# Altium project cam_cross_link_gen.PrjPcb
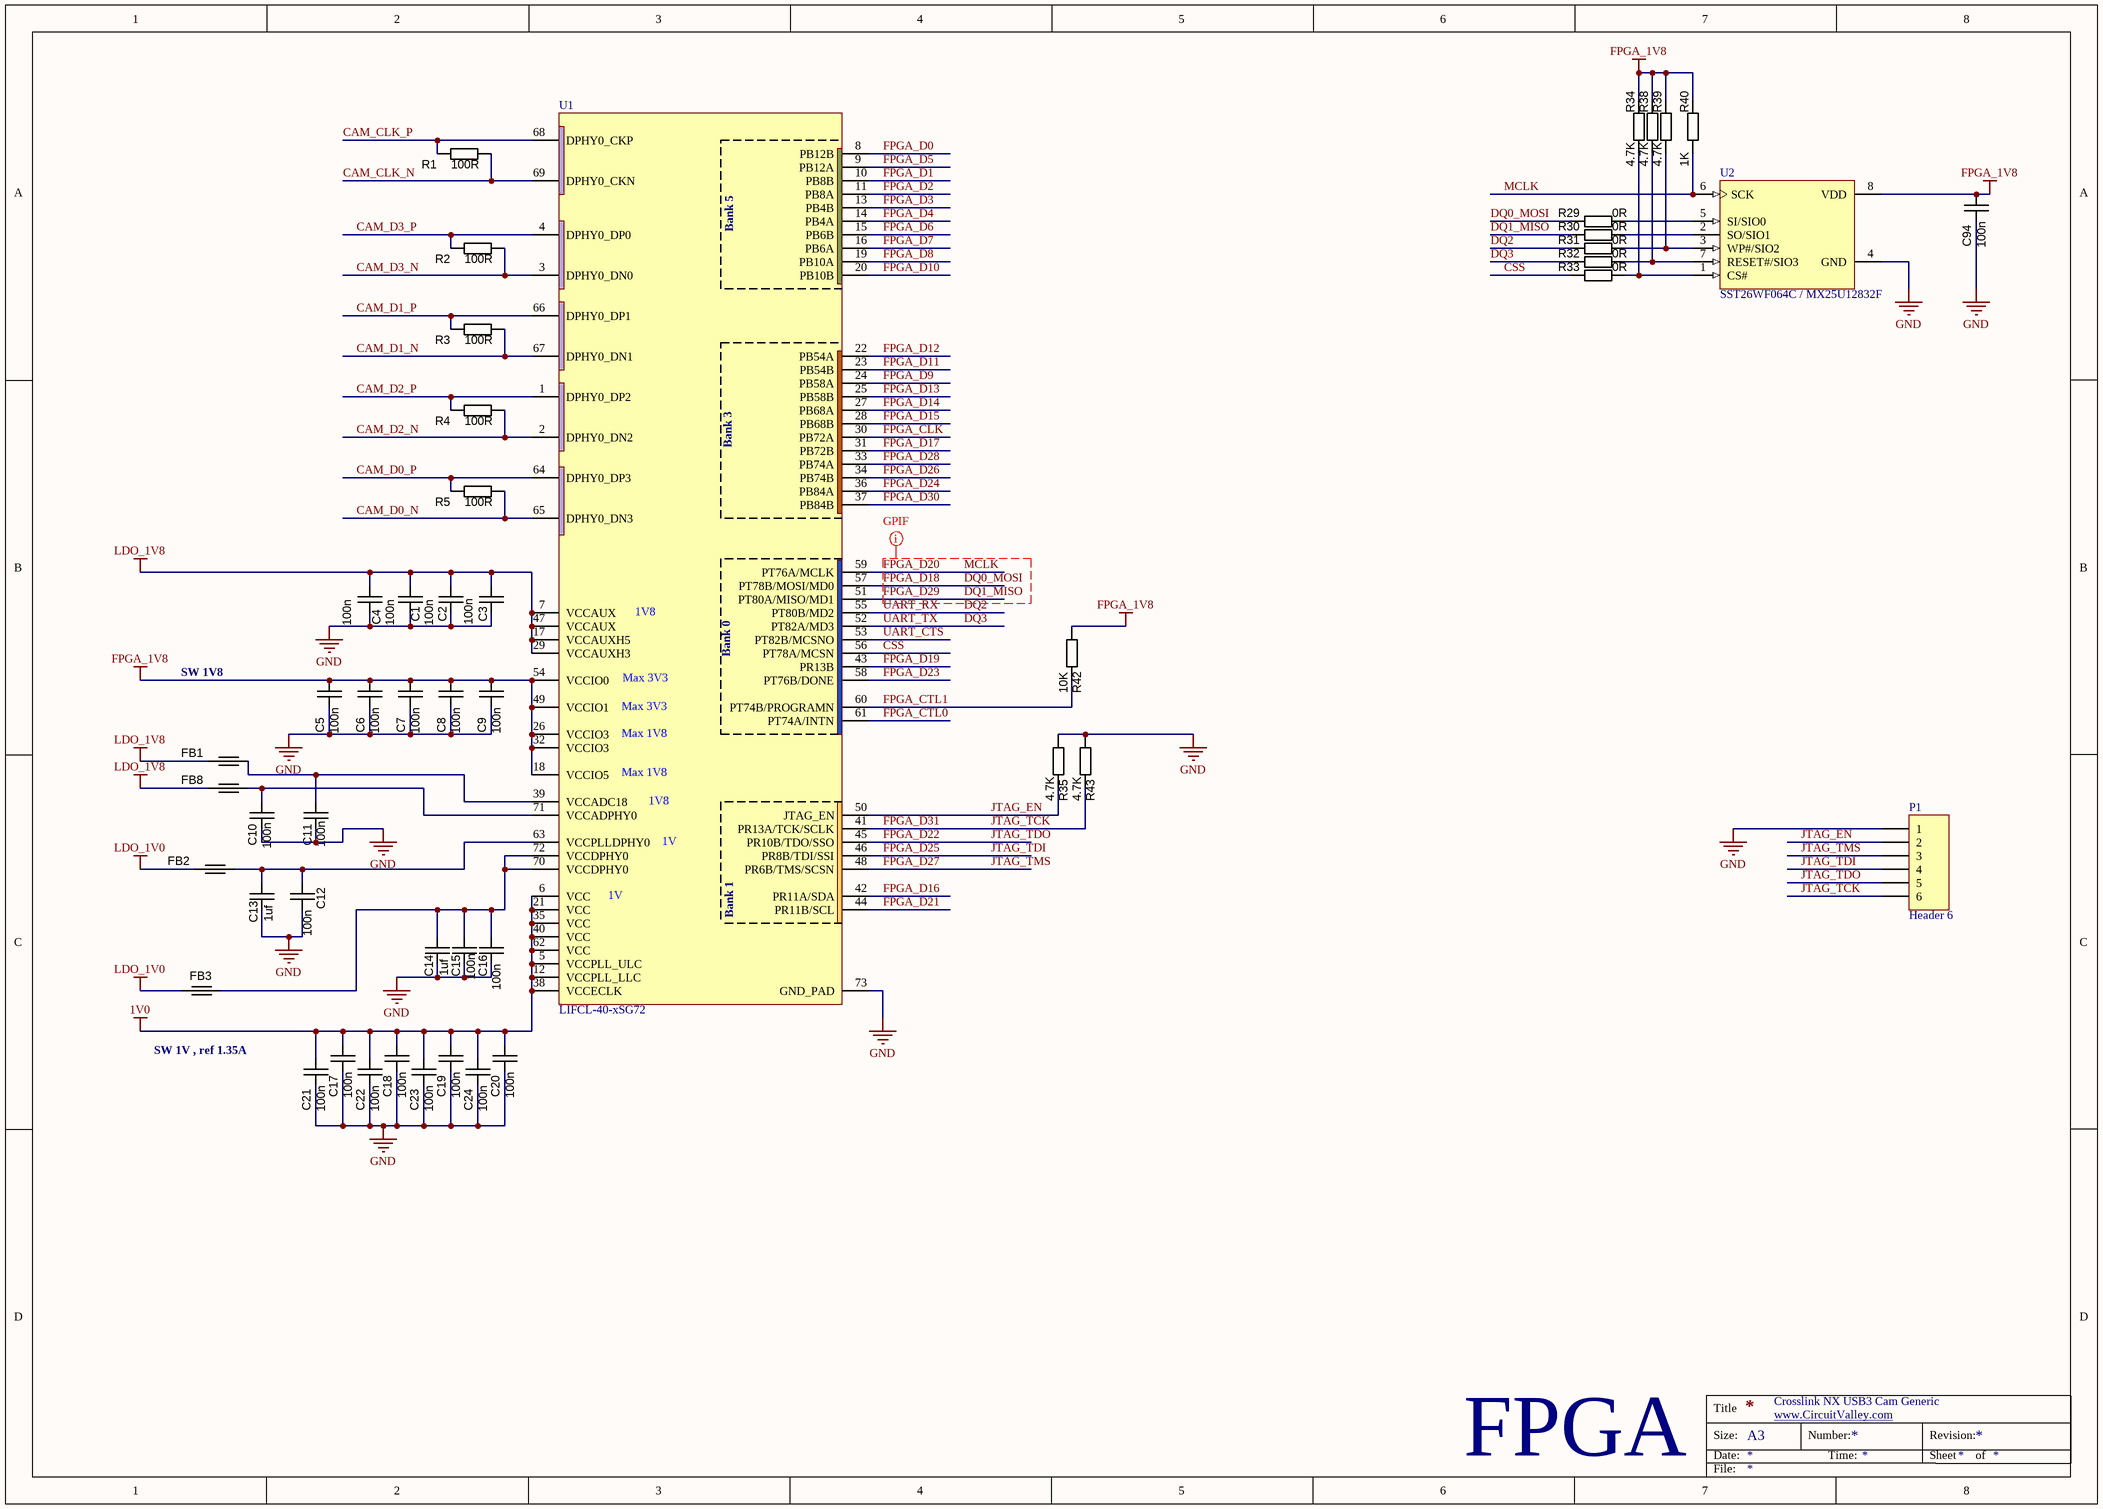
[diagram p0: cam_cross_link.SchDoc]
4 sheets, 173 parts. Net scope: global (net labels, ports and power ports of the same name join across sheets).
Board file: cam_cross_link_generic.PcbDoc
Sheets:
  cam_cross_link.SchDoc
  camera.SchDoc
  power.SchDoc
  usb.SchDoc

## Sheet cam_cross_link.SchDoc
size A3

### Parts
C1  100n  [CAPC1608N]
C2  100n  [CAPC1608N]
C3  100n  [CAPC1608N]
C4  100n  [CAPC1608N]
C5  100n  [CAPC1608N]
C6  100n  [CAPC1608N]
C7  100n  [CAPC1608N]
C8  100n  [CAPC1608N]
C9  100n  [CAPC1608N]
C10  100n  [CAPC1608N]
C11  100n  [CAPC1608N]
C12  100n  [CAPC1608N]
C13  1uf  [CAPC1608N]
C14  1uf  [CAPC1608N]
C15  100n  [CAPC1608N]
C16  100n  [CAPC1608N]
C17  100n  [CAPC1608N]
C18  100n  [CAPC1608N]
C19  100n  [CAPC1608N]
C20  100n  [CAPC1608N]
C21  100n  [CAPC1608N]
C22  100n  [CAPC1608N]
C23  100n  [CAPC1608N]
C24  100n  [CAPC1608N]
C94  100n  [CAPC1608N]
FB1  (no value)  [FBC2012N]
FB2  (no value)  [FBC2012N]
FB3  (no value)  [FBC2012N]
FB8  (no value)  [FBC2012N]
P1  Header 6  [SMD_Solder_points_1.27]
R1  value 100R  [RESC1005N]  (hidden comment: Thick Film)
R2  value 100R  [RESC1005N]  (hidden comment: Thick Film)
R3  value 100R  [RESC1005N]  (hidden comment: Thick Film)
R4  value 100R  [RESC1005N]  (hidden comment: Thick Film)
R5  value 100R  [RESC1005N]  (hidden comment: Thick Film)
R29  value 0R  [RESC1608N_ZERO]  (hidden comment: Thick Film)
R30  value 0R  [RESC1608N_ZERO]  (hidden comment: Thick Film)
R31  value 0R  [RESC1608N_ZERO]  (hidden comment: Thick Film)
R32  value 0R  [RESC1608N_ZERO]  (hidden comment: Thick Film)
R33  value 0R  [RESC1608N_ZERO]  (hidden comment: Thick Film)
R34  value 4.7K  [RESC1608N_ZERO]  (hidden comment: Thick Film)
R35  value 4.7K  [RESC1608N_ZERO]  (hidden comment: Thick Film)
R38  value 4.7K  [RESC1608N_ZERO]  (hidden comment: Thick Film)
R39  value 4.7K  [RESC1608N_ZERO]  (hidden comment: Thick Film)
R40  value 1K  [RESC1608N_ZERO]  (hidden comment: Thick Film)
R42  value 10K  [RESC1608N_ZERO]  (hidden comment: Thick Film)
R43  value 4.7K  [RESC1608N_ZERO]  (hidden comment: Thick Film)
U1  LIFCL-40-xSG72  [QFN72_NX]
U2  SST26WF064C / MX25U12832F  [SOP8]

### Nets
1V0: C17.2 C18.2 C19.2 C20.2 C21.2 C22.2 C23.2 C24.2 U1.5(VCCPLL_ULC) U1.6(VCC) U1.12(VCCPLL_LLC) U1.21(VCC) U1.35(VCC) U1.38(VCCECLK) U1.40(VCC) U1.62(VCC)
FPGA_1V8: C5.2 C6.2 C7.2 C8.2 C9.2 C94.2 R34.1 R38.1 R39.1 R40.1 R42.1 U1.18(VCCIO5) U1.26(VCCIO3) U1.32(VCCIO3) U1.49(VCCIO1) U1.54(VCCIO0) U2.8(VDD)
GND: C1.1 C2.1 C3.1 C4.1 C5.1 C6.1 C7.1 C8.1 C9.1 C10.1 C11.1 C12.2 C13.1 C14.1 C15.1 C16.1 C17.1 C18.1 C19.1 C20.1 C21.1 C22.1 C23.1 C24.1 C94.1 P1.1 R35.1 R43.1 U1.73(GND_PAD) U2.4(GND)
LDO_1V0: FB2.1 FB3.1
LDO_1V8: C1.2 C2.2 C3.2 C4.2 FB1.1 FB8.1 U1.7(VCCAUX) U1.17(VCCAUXH5) U1.29(VCCAUXH3) U1.47(VCCAUX)
CAM_CLK_N: R1.1 U1.69(DPHY0_CKN)
CAM_CLK_P: R1.2 U1.68(DPHY0_CKP)
CAM_D0_N: R5.1 U1.65(DPHY0_DN3)
CAM_D0_P: R5.2 U1.64(DPHY0_DP3)
CAM_D1_N: R3.1 U1.67(DPHY0_DN1)
CAM_D1_P: R3.2 U1.66(DPHY0_DP1)
CAM_D2_N: R4.1 U1.2(DPHY0_DN2)
CAM_D2_P: R4.2 U1.1(DPHY0_DP2)
CAM_D3_N: R2.1 U1.3(DPHY0_DN0)
CAM_D3_P: R2.2 U1.4(DPHY0_DP0)
CSS: R33.2 U1.56(PT78A/MCSN)
DQ0_MOSI: R29.2 U1.57(PT78B/MOSI/MD0)  [also labelled FPGA_D18]
DQ1_MISO: R30.2 U1.51(PT80A/MISO/MD1)  [also labelled FPGA_D29]
DQ2: R31.2 U1.55(PT80B/MD2)  [also labelled UART_RX]
DQ3: R32.2 U1.52(PT82A/MD3)  [also labelled UART_TX]
FPGA_CLK: U1.30(PB72A)
FPGA_CTL0: U1.61(PT74A/INTN)
FPGA_CTL1: R42.2 U1.60(PT74B/PROGRAMN)
FPGA_D0: U1.8(PB12B)
FPGA_D1: U1.10(PB8B)
FPGA_D2: U1.11(PB8A)
FPGA_D3: U1.13(PB4B)
FPGA_D4: U1.14(PB4A)
FPGA_D5: U1.9(PB12A)
FPGA_D6: U1.15(PB6B)
FPGA_D7: U1.16(PB6A)
FPGA_D8: U1.19(PB10A)
FPGA_D9: U1.24(PB58A)
FPGA_D10: U1.20(PB10B)
FPGA_D11: U1.23(PB54B)
FPGA_D12: U1.22(PB54A)
FPGA_D13: U1.25(PB58B)
FPGA_D14: U1.27(PB68A)
FPGA_D15: U1.28(PB68B)
FPGA_D16: U1.42(PR11A/SDA)
FPGA_D17: U1.31(PB72B)
FPGA_D19: U1.43(PR13B)
FPGA_D20: R40.2 U1.59(PT76A/MCLK) U2.6(SCK)  [also labelled MCLK]
FPGA_D21: U1.44(PR11B/SCL)
FPGA_D22: P1.5 U1.45(PR10B/TDO/SSO)  [also labelled JTAG_TDO]
FPGA_D23: U1.58(PT76B/DONE)
FPGA_D24: U1.36(PB84A)
FPGA_D25: P1.4 U1.46(PR8B/TDI/SSI)  [also labelled JTAG_TDI]
FPGA_D26: U1.34(PB74B)
FPGA_D27: P1.3 U1.48(PR6B/TMS/SCSN)  [also labelled JTAG_TMS]
FPGA_D28: U1.33(PB74A)
FPGA_D30: U1.37(PB84B)
FPGA_D31: P1.6 R43.2 U1.41(PR13A/TCK/SCLK)  [also labelled JTAG_TCK]
JTAG_EN: P1.2 R35.2 U1.50(JTAG_EN)
UART_CTS: U1.53(PT82B/MCSNO)
NetC10_2: C10.2 FB8.2 U1.71(VCCADPHY0)
NetC11_2: C11.2 FB1.2 U1.39(VCCADC18)
NetC12_1: C12.1 C13.2 FB2.2 U1.63(VCCPLLDPHY0)
NetC14_2: C14.2 C15.2 C16.2 FB3.2 U1.70(VCCDPHY0) U1.72(VCCDPHY0)
NetR29_1: R29.1 U2.5(SI/SIO0)
NetR30_1: R30.1 U2.2(SO/SIO1)
NetR31_1: R31.1 R39.2 U2.3(WP#/SIO2)
NetR32_1: R32.1 R38.2 U2.7(RESET#/SIO3)
NetR33_1: R33.1 R34.2 U2.1(CS#)

### Layout directives
net class GPIF: DQ0_MOSI, DQ1_MISO, FPGA_D18, FPGA_D20, FPGA_D29, MCLK

### Notes on the sheet
- SW 1V8
- SW 1V , ref 1.35A
- Crosslink NX USB3 Cam Generic
- www.CircuitValley.com <http://www.CircuitValley.com>
- FPGA
- Title
- Size:
- Date:
- A3
- Number:
- Time:
- Revision:
- Sheet
- of
- File:
- (in symbol LIFCL-40-xSG72) Bank 5; Bank 3; 1V8; Bank 0; Max 3V3; Max 1V8; 1V; Bank 1

### Library data of the parts
C1-C24 C94 = CAPC_10p_0603_NP0_1%_50V: Capacitor SMD Cer 10pF 5% 50V NP0 0603; Manufacturer 1: Murata Electronics North America; Manufacturer Part Number 1: GRM1885C1H100FA01J; Part: C0603X104K5RAC; Ratings: 50V; NP0; Tolerance: ±5%; Operating Temperature: -55°C ~ 125°C; Package / Case: 0603 (1608 Metric); Size / Dimension: 0.063" L x 0.032" W (1.60mm x 0.81mm); Thickness (Max): 0.035" (0.90mm); Supplier 1: Digi-Key; Supplier Part Number 1: GRM1885C1H100FA01J-ND
  C1-C12 C15-C24 C94: Value: 100n
  C13 C14: Value: 1uf
FB1-FB3 FB8 = FERRITE_0805: Ferrite bead 2.2K Ohm at 100 MHz 200mA 0805 SMD; Manufacturer 1: Laird-Signal Integrity Products; Manufacturer Part Number 1: HZ0805B222R-10; Ratings: 200 mA; 800 mOhm DC; Impedance @ Frequency: 600 Ohm @ 100MHz; DC Resistance (DCR): 800 mOhm Max; Filter Type: Differential Mode - Single; Size / Dimension: 0.063" L x 0.031" W (1.60mm x 0.80mm); Current Rating: 200mA; Package / Case: 0805 (2012 Metric); Height (Max): 0.043" (1.09mm); ComponentLink1URL: http://www.lairdtech.com/WorkArea/linkit.aspx?LinkIdentifier=id&ItemID=4879; ComponentLink1Description: http://www.lairdtech.com/WorkArea/linkit.aspx?LinkIdentifier=id&ItemID=4879; Supplier 1: Digi-Key; Supplier Part Number 1: 240-2562-1-ND; Mounting Type: Surface Mount
P1 = Header 6: Header, 6-Pin; LatestRevisionDate: 17-Jul-2002; LatestRevisionNote: Re-released for DXP Platform.; Publisher: Altium Limited
R1-R5 = RES_1M_0402_5%: Resistor SMD chip 1M Ohm 0.063W 5% 0402; Manufacturer 1: Vishay Dale; Manufacturer Part Number 1: CRCW04021M00JNED; Ratings: 1/16 W; Power Rating: 0.063W, 1/16W; Package / Case: 0402 (1005 Metric); Tolerance: ±5%; Material: Thick Film; Manufacturer 2: Yageo; Manufacturer Part Number 2: RC0402JR-071ML; Supplier 1: Digi-Key; Supplier Part Number 1: 541-1.0MJCT-ND; ComponentLink1URL: http://www.vishay.com/doc?20035; ComponentLink1Description: http://www.vishay.com/doc?20035; Supplier 2: Digi-Key; Supplier Part Number 2: 311-1.0MJRCT-ND; ComponentLink2URL: http://www.yageo.com/documents/recent/PYu-RC0402_51_RoHS_L_6.pdf; ComponentLink2Description: http://www.yageo.com/documents/recent/PYu-RC0402_51_RoHS_L_6.pdf
R29-R35 R38-R40 R42 R43 = RES_0R_0603: Resistor SMD chip 0.0 Ohm 0.1W 0603; Manufacturer 1: Vishay/Dale; Manufacturer Part Number 1: CRCW06030000Z0EA; Tolerance: ±5%; Ratings: 1/10W; Package / Case: 0603 (1608metric); Supplier 1: Digi-Key; Supplier Part Number 1: 541-0.0GCT-ND
U1 = LIFCL-40-xSG72: QFN 72 LIFCL
U2 = MX25L12833F: Flash 128Mbit for Lattice FPGA

## Sheet camera.SchDoc
size A3
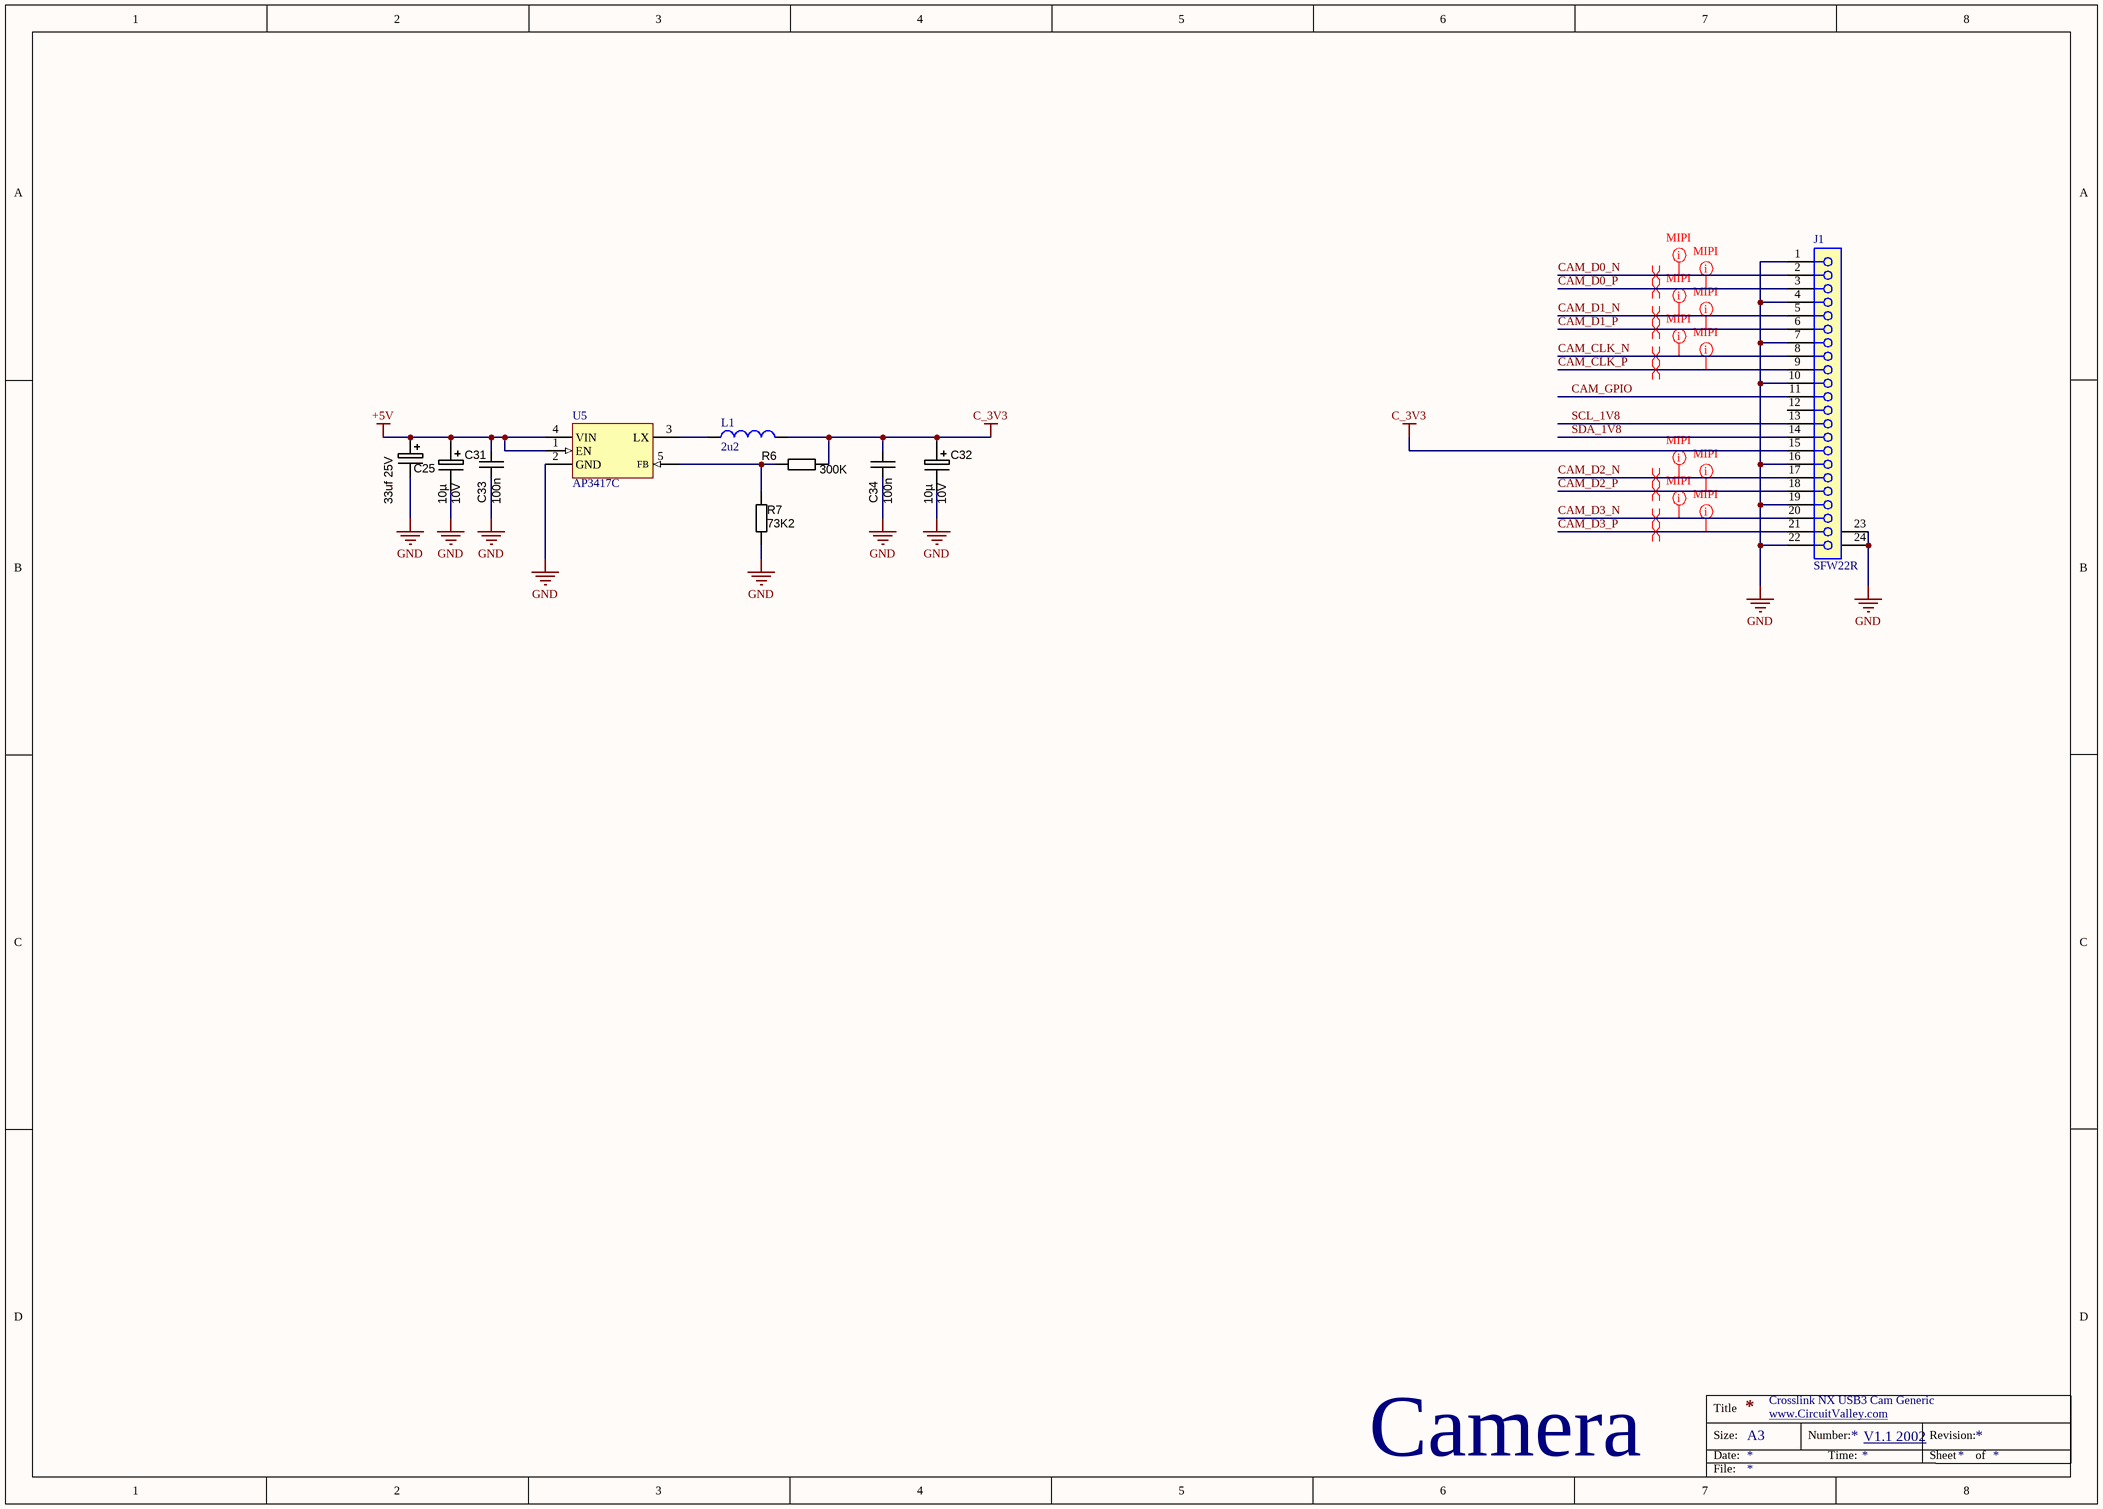
[diagram p1: camera.SchDoc]

### Parts
C25  value 33uf 25V  [CAPMP7343X310N]  (hidden comment: 33uf 20V D)
C31  Ratings: 10V  [CAPMP3528X210N]  (hidden comment: 10µ)
C32  Ratings: 10V  [CAPMP3528X210N]  (hidden comment: 10µ)
C33  100n  [CAPC1608N]
C34  100n  [CAPC1608N]
J1  SFW22R  [SFW22R]
L1  2u2  [TAIYO_NRS4018T2R2MDGJ]
R6  value 300K  [RESC1608N_ZERO]  (hidden comment: Thick Film)
R7  value 73K2  [RESC1608N_ZERO]  (hidden comment: Thick Film)
U5  AP3417C  [SOT23-5]

### Nets
+5V: C25.1 C31.1 C33.2 U5.1(EN) U5.4(VIN)
C_3V3: C32.1 C34.2 J1.15 L1.2 R6.1
GND: C25.2 C31.2 C32.2 C33.1 C34.1 J1.1 J1.4 J1.7 J1.10 J1.16 J1.19 J1.22 J1.23 J1.24 R7.2 U5.2(GND)
CAM_CLK_N: J1.8
CAM_CLK_P: J1.9
CAM_D0_N: J1.2
CAM_D0_P: J1.3
CAM_D1_N: J1.5
CAM_D1_P: J1.6
CAM_D2_N: J1.17
CAM_D2_P: J1.18
CAM_D3_N: J1.20
CAM_D3_P: J1.21
CAM_GPIO: J1.11
SCL_1V8: J1.13
SDA_1V8: J1.14
NetL1_1: L1.1 U5.3(LX)
NetR6_2: R6.2 R7.1 U5.5(FB)

Not connected (* = marked no-connect by the designer): J1 12

### Layout directives
differential pair: CAM_CLK_N, CAM_CLK_P, CAM_D0_N, CAM_D0_P, CAM_D1_N, CAM_D1_P, CAM_D2_N, CAM_D2_P, CAM_D3_N, CAM_D3_P
net class MIPI: CAM_CLK_N, CAM_CLK_P, CAM_D0_N, CAM_D0_P, CAM_D1_N, CAM_D1_P, CAM_D2_N, CAM_D2_P, CAM_D3_N, CAM_D3_P

### Notes on the sheet
- Crosslink NX USB3 Cam Generic
- www.CircuitValley.com <http://www.CircuitValley.com>
- V1.1 2002
- Camera
- Title
- Size:
- Date:
- A3
- Number:
- Time:
- Revision:
- Sheet
- of
- File:

### Library data of the parts
C25 = CAPT_330u_2917_6V3: Capacitor SMD Tant 330uF 20% 6V3 2917; Manufacturer Part Number: T520D337M006ATE015; Part: TAJD336K020R; Ratings: 6.3V; Material: Solid Tantalum; ESR (Equivalent Series Resistance): 15 mOhm; Package / Case: 2917 (7343 Metric); Tolerance: ±20%; Operating Temperature: -55°C ~ 125°C; Size / Dimension: 0.287" L x 0.169" W (7.30mm x 4.30mm); Height - Seated (Max): 0.122" (3.10mm); Manufacturer Size Code: D; Supplier 1: Digi-Key; Supplier Part Number 1: 399-4052-1-ND; ComponentLink1URL: http://www.kemet.com/datasheets&T520D337M006ATE015; ComponentLink1Description: T520D Datasheet
C31 C32 = CAPT_47u_1210_6V3: Capacitor SMD Tantalum 47uF 20% 6.3V 1210; Manufacturer 1: AVX Corporation; Manufacturer Part Number 1: TCJB476M006R0070; Manufacturer Size Code: B; Voltage - Rated: 6V3; ESR (Equivalent Series Resistance): 70.0 mOhm; Type: Molded; Package / Case: 1210 (3528 Metric); Tolerance: ±20%; Material: Tantalum; Supplier 1: Digi-Key; Supplier Part Number 1: 478-3139-1-ND; Operating Temperature: -55°C ~ 125°C; Size / Dimension: 0.138" L x 0.110" W (3.50mm x 2.80mm); Height - Seated (Max): 0.083" (2.10mm); ComponentLink1URL: http://www.avx.com/docs/Catalogs/tcj.pdf; ComponentLink1Description: http://www.avx.com/docs/Catalogs/tcj.pdf; Value: 10µ
C33 C34 = CAPC_10p_0603_NP0_1%_50V: as C1 on sheet cam_cross_link; Tolerance: ±5%; Operating Temperature: -55°C ~ 125°C; Package / Case: 0603 (1608 Metric); Size / Dimension: 0.063" L x 0.032" W (1.60mm x 0.81mm); Thickness (Max): 0.035" (0.90mm); Supplier 1: Digi-Key; Supplier Part Number 1: GRM1885C1H100FA01J-ND; Value: 100n
J1 = SFW22R: 22 Pin FPC
L1 = inductor_smd: PartNumber: NRS4018T2R2MDGJ
R6 R7 = RES_0R_0603: as R29 on sheet cam_cross_link; Package / Case: 0603 (1608metric); Supplier 1: Digi-Key; Supplier Part Number 1: 541-0.0GCT-ND

## Sheet power.SchDoc
size A3
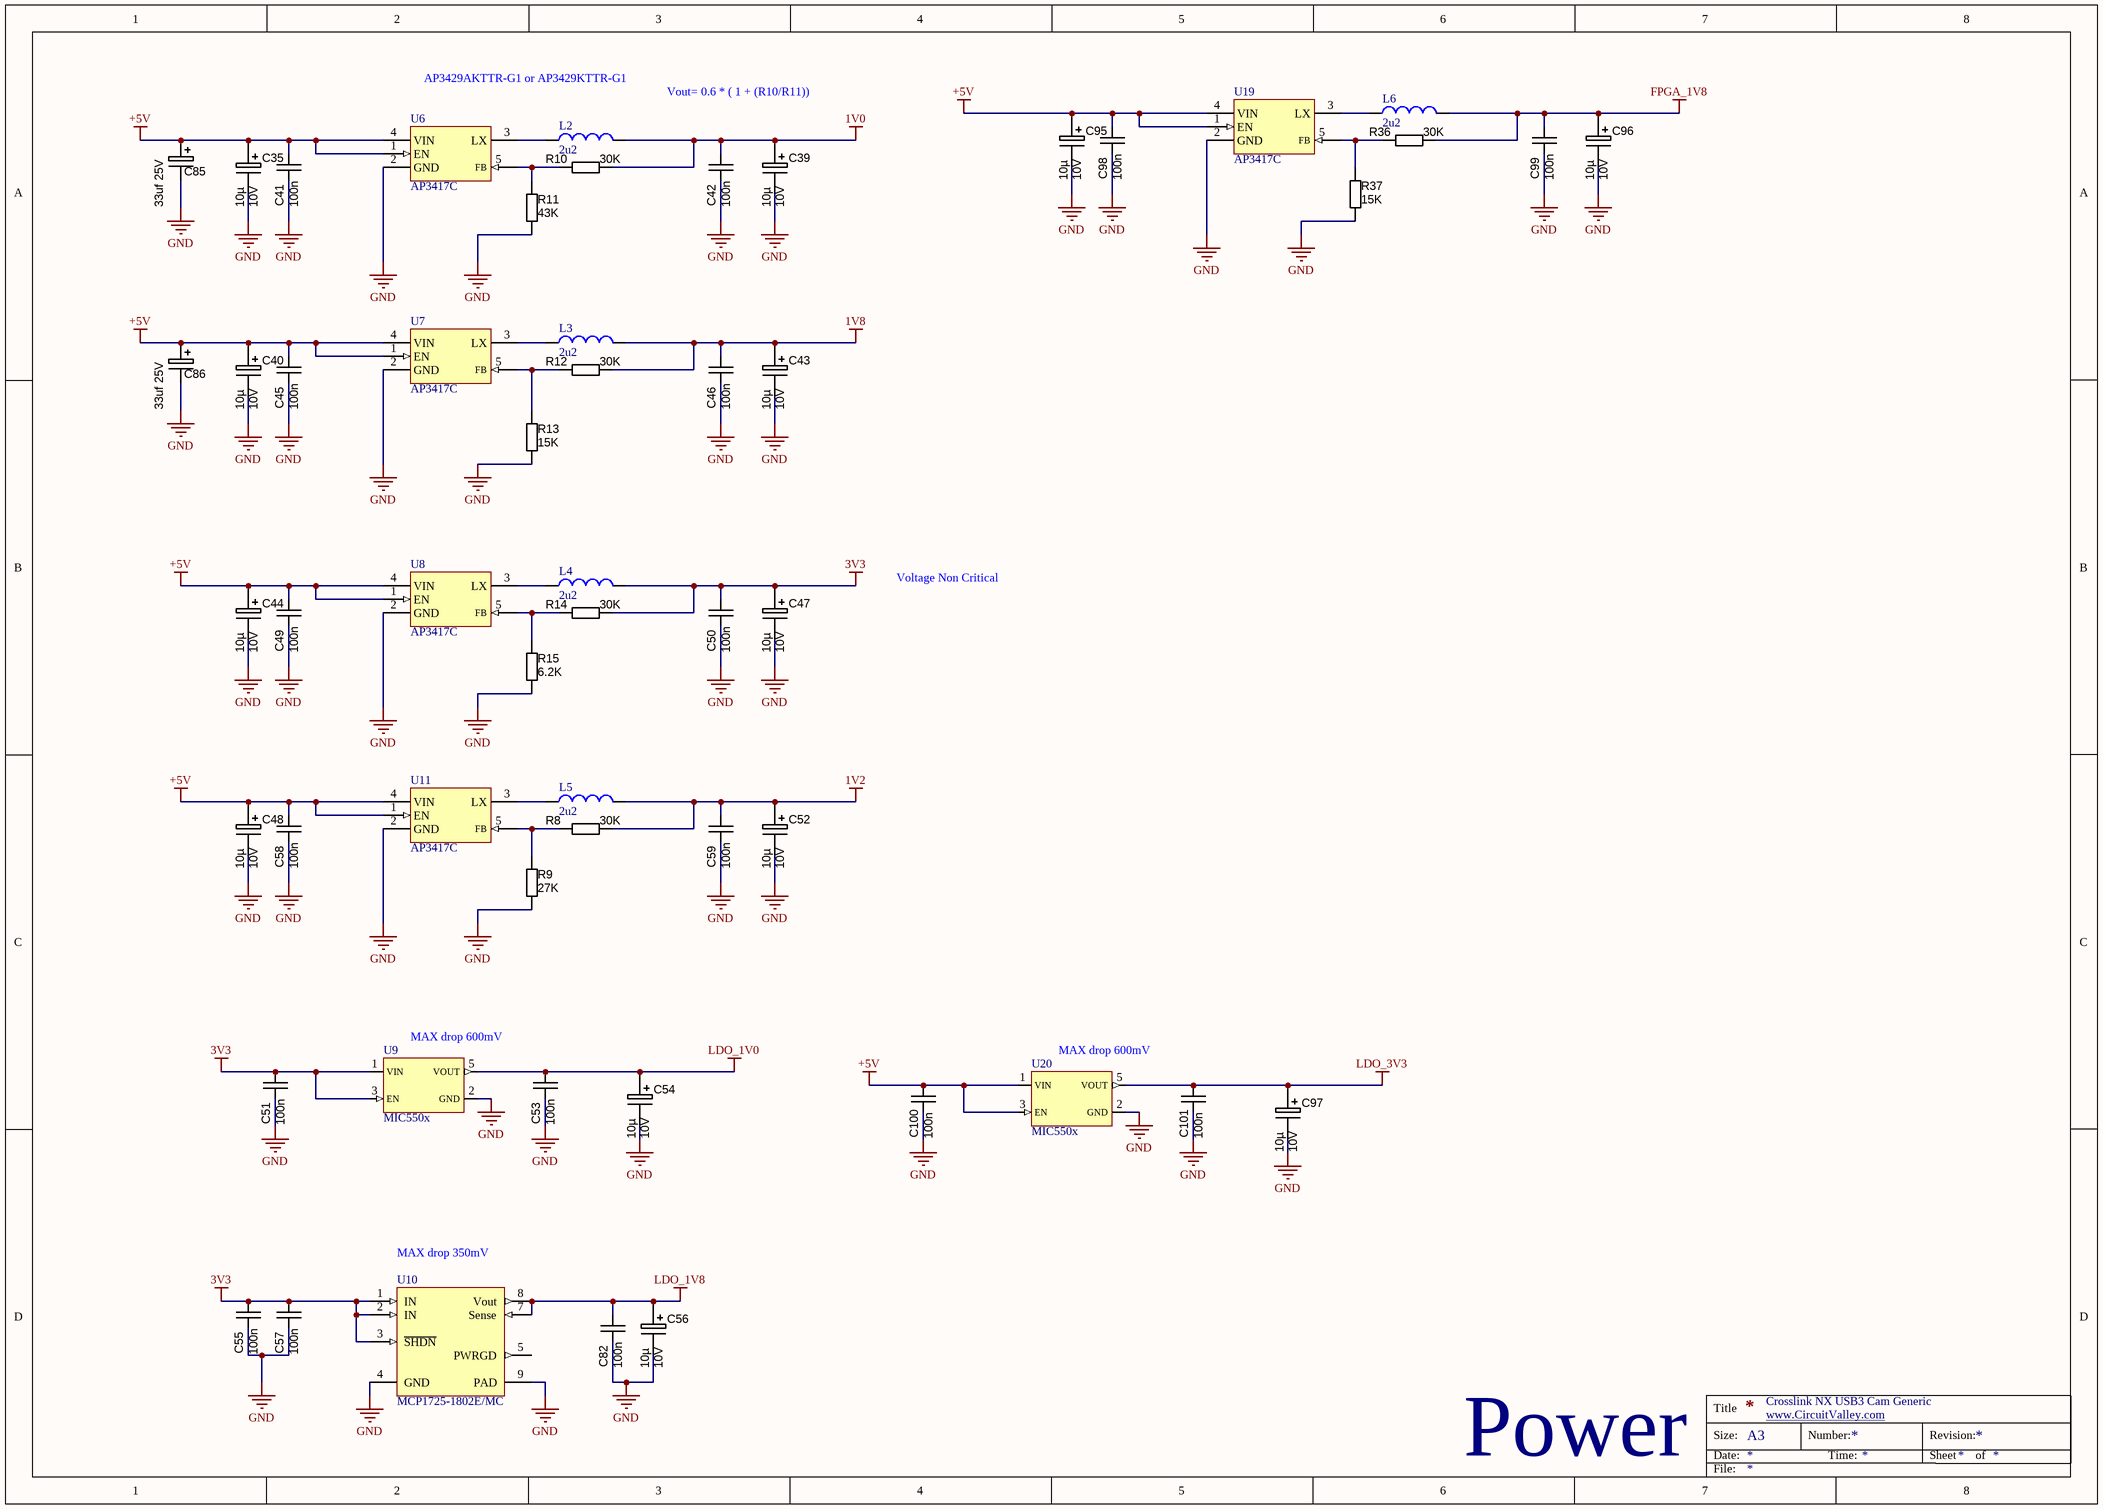
[diagram p2: power.SchDoc]

### Parts
C35  Ratings: 10V  [CAPMP3528X210N]  (hidden comment: 10µ)
C39  Ratings: 10V  [CAPMP3528X210N]  (hidden comment: 10µ)
C40  Ratings: 10V  [CAPMP3528X210N]  (hidden comment: 10µ)
C41  100n  [CAPC1608N]
C42  100n  [CAPC1608N]
C43  Ratings: 10V  [CAPMP3528X210N]  (hidden comment: 10µ)
C44  Ratings: 10V  [CAPMP3528X210N]  (hidden comment: 10µ)
C45  100n  [CAPC1608N]
C46  100n  [CAPC1608N]
C47  Ratings: 10V  [CAPMP3528X210N]  (hidden comment: 10µ)
C48  Ratings: 10V  [CAPMP3528X210N]  (hidden comment: 10µ)
C49  100n  [CAPC1608N]
C50  100n  [CAPC1608N]
C51  100n  [CAPC1608N]
C52  Ratings: 10V  [CAPMP3528X210N]  (hidden comment: 10µ)
C53  100n  [CAPC1608N]
C54  Ratings: 10V  [CAPMP3528X210N]  (hidden comment: 10µ)
C55  100n  [CAPC1608N]
C56  Ratings: 10V  [CAPMP3528X210N]  (hidden comment: 10µ)
C57  100n  [CAPC1608N]
C58  100n  [CAPC1608N]
C59  100n  [CAPC1608N]
C82  100n  [CAPC1608N]
C85  value 33uf 25V  [CAPMP7343X310N]  (hidden comment: 33uf 20V D)
C86  value 33uf 25V  [CAPMP7343X310N]  (hidden comment: 33uf 20V D)
C95  Ratings: 10V  [CAPMP3528X210N]  (hidden comment: 10µ)
C96  Ratings: 10V  [CAPMP3528X210N]  (hidden comment: 10µ)
C97  Ratings: 10V  [CAPMP3528X210N]  (hidden comment: 10µ)
C98  100n  [CAPC1608N]
C99  100n  [CAPC1608N]
C100  100n  [CAPC1608N]
C101  100n  [CAPC1608N]
L2  2u2  [TAIYO_NRS4018T2R2MDGJ]
L3  2u2  [TAIYO_NRS4018T2R2MDGJ]
L4  2u2  [TAIYO_NRS4018T2R2MDGJ]
L5  2u2  [TAIYO_NRS4018T2R2MDGJ]
L6  2u2  [TAIYO_NRS4018T2R2MDGJ]
R8  value 30K  [RESC1608N_ZERO]  (hidden comment: Thick Film)
R9  value 27K  [RESC1608N_ZERO]  (hidden comment: Thick Film)
R10  value 30K  [RESC1608N_ZERO]  (hidden comment: Thick Film)
R11  value 43K  [RESC1608N_ZERO]  (hidden comment: Thick Film)
R12  value 30K  [RESC1608N_ZERO]  (hidden comment: Thick Film)
R13  value 15K  [RESC1608N_ZERO]  (hidden comment: Thick Film)
R14  value 30K  [RESC1608N_ZERO]  (hidden comment: Thick Film)
R15  value 6.2K  [RESC1608N_ZERO]  (hidden comment: Thick Film)
R36  value 30K  [RESC1608N_ZERO]  (hidden comment: Thick Film)
R37  value 15K  [RESC1608N_ZERO]  (hidden comment: Thick Film)
U6  AP3417C  [SOT23-5]
U7  AP3417C  [SOT23-5]
U8  AP3417C  [SOT23-5]
U9  MIC550x  [SOT23-5]
U10  MCP1725-1802E/MC  [DFN8_3x2]
U11  AP3417C  [SOT23-5]
U19  AP3417C  [SOT23-5]
U20  MIC550x  [SOT23-5]

### Nets
1V0: C39.1 C42.2 L2.2 R10.1
1V2: C52.1 C59.2 L5.2 R8.1
1V8: C43.1 C46.2 L3.2 R12.1
3V3: C47.1 C50.2 C51.2 C55.2 C57.2 L4.2 R14.1 U9.1(VIN) U9.3(EN) U10.1(IN) U10.2(IN) U10.3(~{SHDN})
+5V: C35.1 C40.1 C41.2 C44.1 C45.2 C48.1 C49.2 C58.2 C85.1 C86.1 C95.1 C98.2 C100.2 U6.1(EN) U6.4(VIN) U7.1(EN) U7.4(VIN) U8.1(EN) U8.4(VIN) U11.1(EN) U11.4(VIN) U19.1(EN) U19.4(VIN) U20.1(VIN) U20.3(EN)
FPGA_1V8: C96.1 C99.2 L6.2 R36.1
GND: C35.2 C39.2 C40.2 C41.1 C42.1 C43.2 C44.2 C45.1 C46.1 C47.2 C48.2 C49.1 C50.1 C51.1 C52.2 C53.1 C54.2 C55.1 C56.2 C57.1 C58.1 C59.1 C82.1 C85.2 C86.2 C95.2 C96.2 C97.2 C98.1 C99.1 C100.1 C101.1 R9.2 R11.2 R13.2 R15.2 R37.2 U6.2(GND) U7.2(GND) U8.2(GND) U9.2(GND) U10.4(GND) U10.9(PAD) U11.2(GND) U19.2(GND) U20.2(GND)
LDO_1V0: C53.2 C54.1 U9.5(VOUT)
LDO_1V8: C56.1 C82.2 U10.7(Sense) U10.8(Vout)
LDO_3V3: C97.1 C101.2 U20.5(VOUT)
NetL2_1: L2.1 U6.3(LX)
NetL3_1: L3.1 U7.3(LX)
NetL4_1: L4.1 U8.3(LX)
NetL5_1: L5.1 U11.3(LX)
NetL6_1: L6.1 U19.3(LX)
NetR8_2: R8.2 R9.1 U11.5(FB)
NetR10_2: R10.2 R11.1 U6.5(FB)
NetR12_2: R12.2 R13.1 U7.5(FB)
NetR14_2: R14.2 R15.1 U8.5(FB)
NetR36_2: R36.2 R37.1 U19.5(FB)

Not connected (* = marked no-connect by the designer): U10 5(PWRGD)

### Notes on the sheet
- AP3429AKTTR-G1 or AP3429KTTR-G1
- Vout= 0.6 * ( 1 + (R10/R11))
- Voltage Non Critical
- (near U9) MAX drop 600mV
- (near U20) MAX drop 600mV
- (near U10) MAX drop 350mV
- Crosslink NX USB3 Cam Generic
- www.CircuitValley.com <http://www.CircuitValley.com>
- Power
- Title
- Size:
- Date:
- A3
- Number:
- Time:
- Revision:
- Sheet
- of
- File:

### Library data of the parts
C35 C39 C40 C43 C44 C47 C48 C52 C54 C56 C95-C97 = CAPT_47u_1210_6V3: as C31 on sheet camera; Package / Case: 1210 (3528 Metric); Tolerance: ±20%; Material: Tantalum; Supplier 1: Digi-Key; Supplier Part Number 1: 478-3139-1-ND; Operating Temperature: -55°C ~ 125°C; Size / Dimension: 0.138" L x 0.110" W (3.50mm x 2.80mm); Height - Seated (Max): 0.083" (2.10mm); ComponentLink1URL: http://www.avx.com/docs/Catalogs/tcj.pdf; ComponentLink1Description: http://www.avx.com/docs/Catalogs/tcj.pdf; Value: 10µ
C41 C42 C45 C46 C49-C51 C53 C55 C57-C59 C82 C98-C101 = CAPC_10p_0603_NP0_1%_50V: as C1 on sheet cam_cross_link; Tolerance: ±5%; Operating Temperature: -55°C ~ 125°C; Package / Case: 0603 (1608 Metric); Size / Dimension: 0.063" L x 0.032" W (1.60mm x 0.81mm); Thickness (Max): 0.035" (0.90mm); Supplier 1: Digi-Key; Supplier Part Number 1: GRM1885C1H100FA01J-ND; Value: 100n
C85 C86 = CAPT_330u_2917_6V3: as C25 on sheet camera; Package / Case: 2917 (7343 Metric); Tolerance: ±20%; Operating Temperature: -55°C ~ 125°C; Size / Dimension: 0.287" L x 0.169" W (7.30mm x 4.30mm); Height - Seated (Max): 0.122" (3.10mm); Manufacturer Size Code: D; Supplier 1: Digi-Key; Supplier Part Number 1: 399-4052-1-ND; ComponentLink1URL: http://www.kemet.com/datasheets&T520D337M006ATE015; ComponentLink1Description: T520D Datasheet
L2-L6 = inductor_smd: PartNumber: NRS4018T2R2MDGJ
R8-R15 R36 R37 = RES_0R_0603: as R29 on sheet cam_cross_link; Package / Case: 0603 (1608metric); Supplier 1: Digi-Key; Supplier Part Number 1: 541-0.0GCT-ND
U10 = MCP1725: LDO

## Sheet usb.SchDoc
size A3
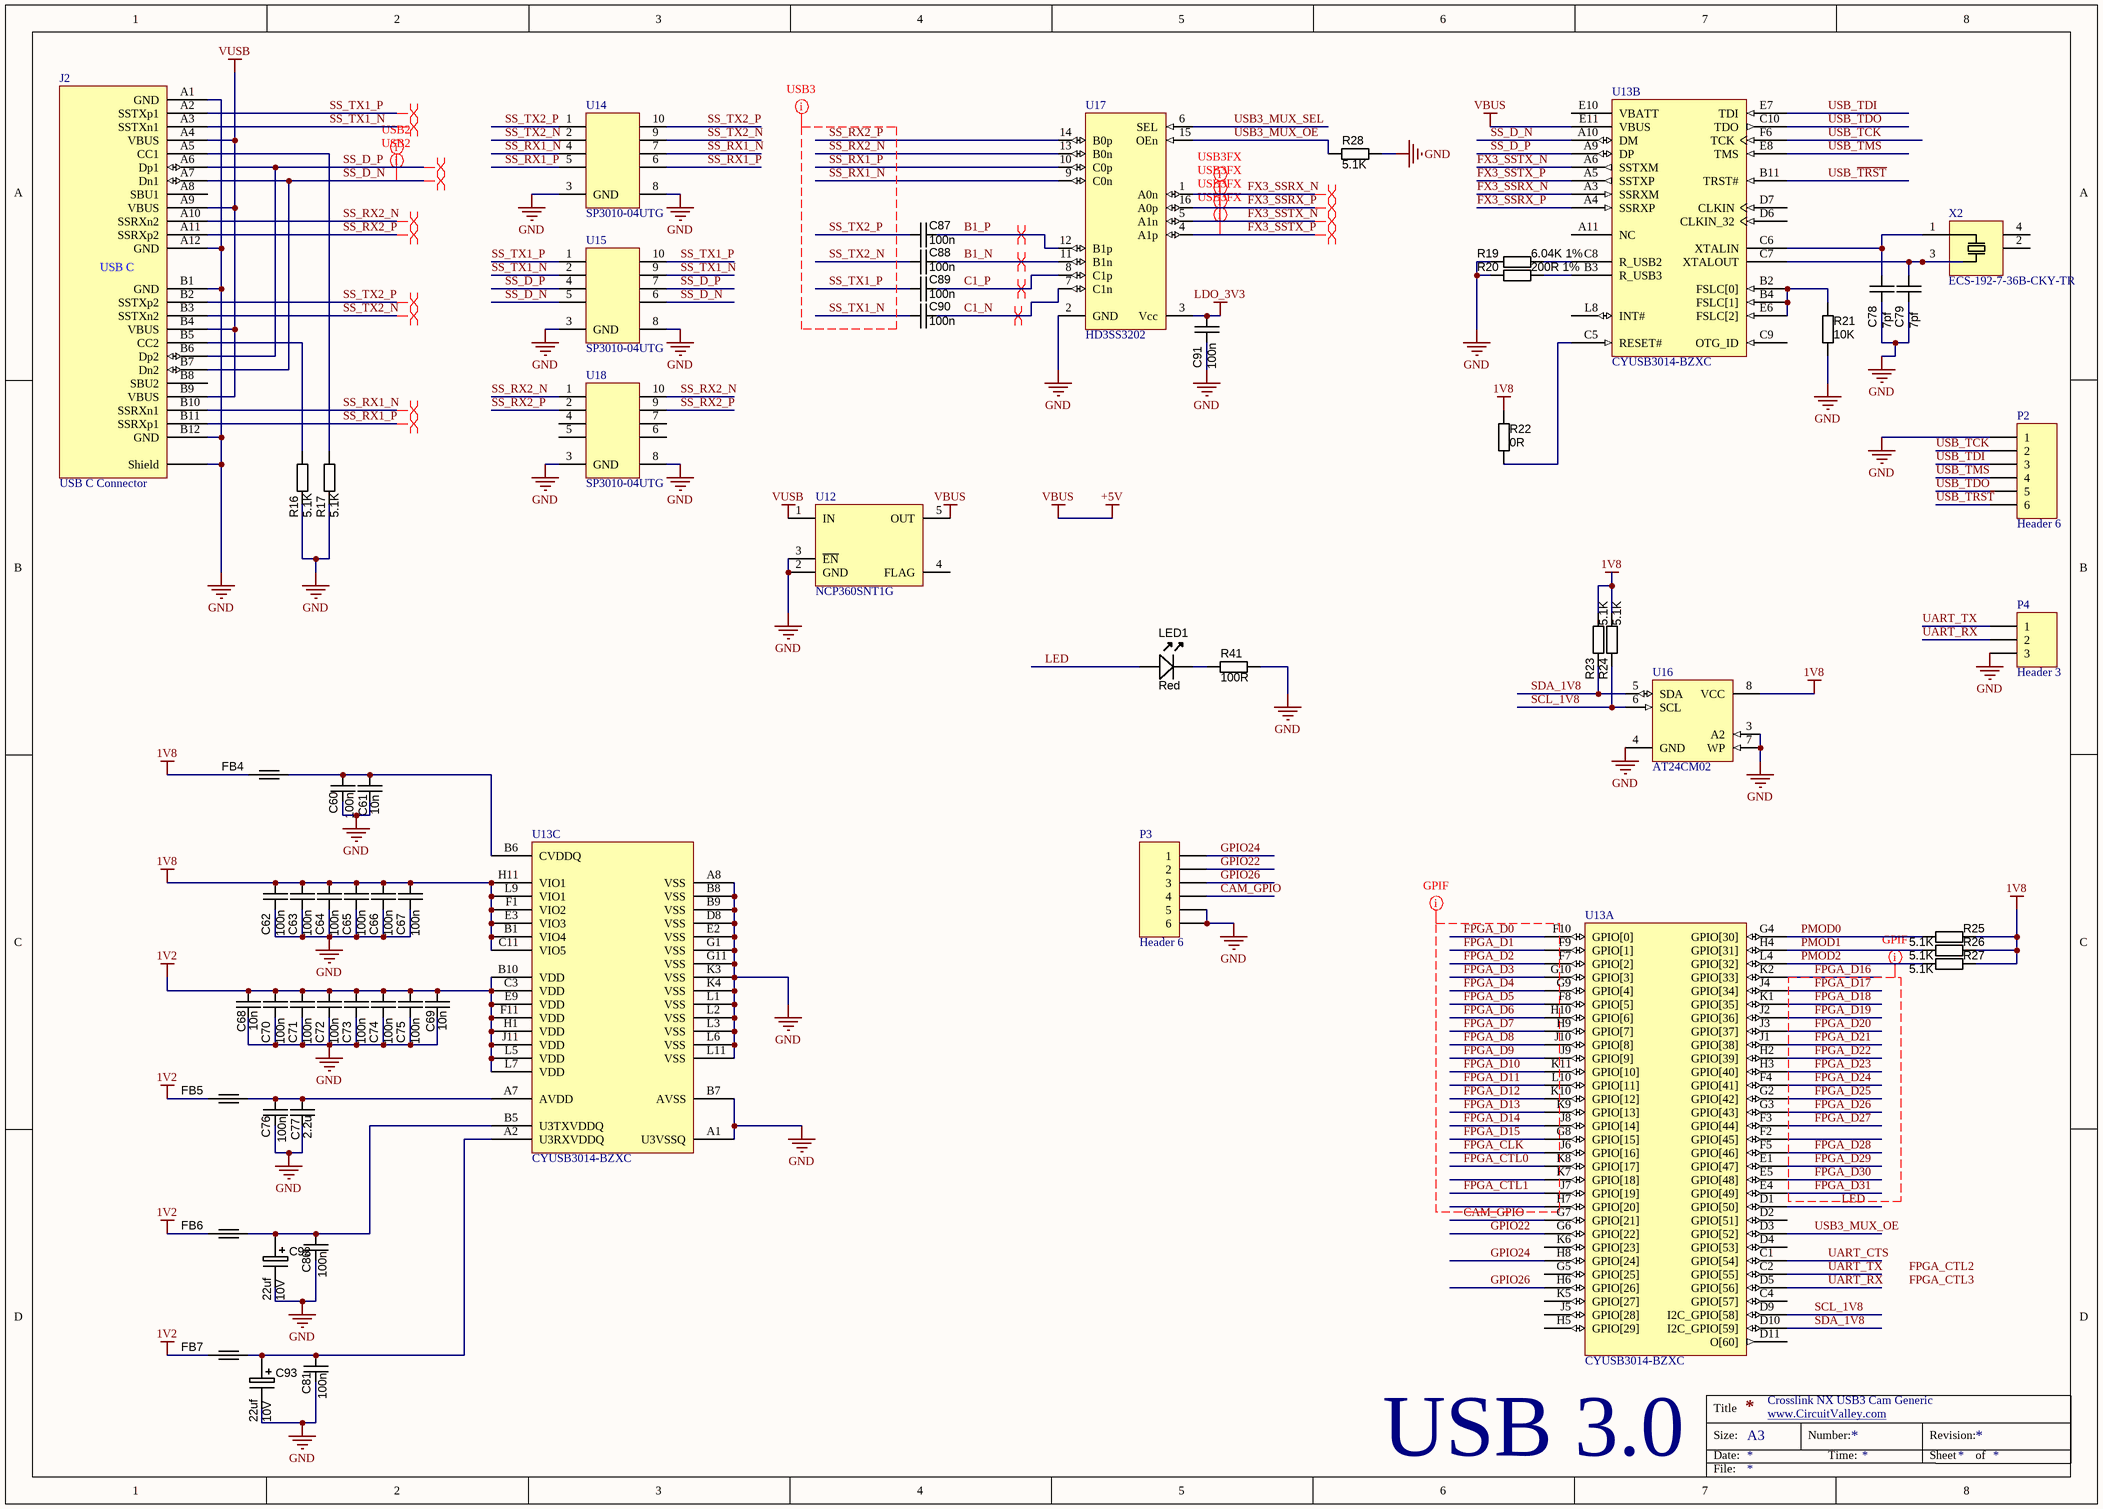
[diagram p3: usb.SchDoc]

### Parts
C60  100n  [CAPC1608N]
C61  10n  [CAPC1608N]
C62  100n  [CAPC1608N]
C63  100n  [CAPC1608N]
C64  100n  [CAPC1608N]
C65  100n  [CAPC1608N]
C66  100n  [CAPC1608N]
C67  100n  [CAPC1608N]
C68  10n  [CAPC1608N]
C69  10n  [CAPC1608N]
C70  100n  [CAPC1608N]
C71  100n  [CAPC1608N]
C72  100n  [CAPC1608N]
C73  100n  [CAPC1608N]
C74  100n  [CAPC1608N]
C75  100n  [CAPC1608N]
C76  100n  [CAPC1608N]
C77  2.2u  [CAPC1608N]
C78  7pf  [CAPC1608N]
C79  7pf  [CAPC1608N]
C80  100n  [CAPC1608N]
C81  100n  [CAPC1608N]
C87  100n  [CAPC1005N]
C88  100n  [CAPC1005N]
C89  100n  [CAPC1005N]
C90  100n  [CAPC1005N]
C91  100n  [CAPC1608N]
C92  Ratings: 10V  [CAPMP3528X210N]  (hidden comment: 22uf)
C93  Ratings: 10V  [CAPMP3528X210N]  (hidden comment: 22uf)
FB4  (no value)  [FBC2012N]
FB5  (no value)  [FBC2012N]
FB6  (no value)  [FBC2012N]
FB7  (no value)  [FBC2012N]
J2  USB C Connector  [10137062-00021LF]
LED1  Red  [LED-0603-RED]
P2  Header 6  [SMD_Solder_points_1.27]
P3  Header 6  [SMD_Solder_points_1.27]
P4  Header 3  [SMD_3Solder_points_1.27]
R16  value 5.1K  [RESC1608N_ZERO]  (hidden comment: Thick Film)
R17  value 5.1K  [RESC1608N_ZERO]  (hidden comment: Thick Film)
R19  value 6.04K 1%  [RESC1608N_ZERO]  (hidden comment: Thick Film)
R20  value 200R 1%  [RESC1608N_ZERO]  (hidden comment: Thick Film)
R21  value 10K  [RESC1608N_ZERO]  (hidden comment: Thick Film)
R22  value 0R  [RESC1608N_ZERO]  (hidden comment: Thick Film)
R23  value 5.1K  [RESC1608N_ZERO]  (hidden comment: Thick Film)
R24  value 5.1K  [RESC1608N_ZERO]  (hidden comment: Thick Film)
R25  value 5.1K  [RESC1608N_ZERO]  (hidden comment: Thick Film)
R26  value 5.1K  [RESC1608N_ZERO]  (hidden comment: Thick Film)
R27  value 5.1K  [RESC1608N_ZERO]  (hidden comment: Thick Film)
R28  value 5.1K  [RESC1608N_ZERO]  (hidden comment: Thick Film)
R41  value 100R  [RESC1608N_ZERO]  (hidden comment: Thick Film)
U12  NCP360SNT1G  [SOT23-5]
U13  CYUSB3014-BZXC  [CYP-BZX121]  (parts A,B,C of 3)
U14  SP3010-04UTG  [uDFN-10]
U15  SP3010-04UTG  [uDFN-10]
U16  AT24CM02  [SOIC8]
U17  HD3SS3202  [UQFN-16]
U18  SP3010-04UTG  [uDFN-10]
X2  ECS-192-7-36B-CKY-TR  [Active Oscillator 2520]

### Nets
1V2: C68.2 C69.2 C70.2 C71.2 C72.2 C73.2 C74.2 C75.2 FB5.1 FB6.1 FB7.1 U13.B10(VDD) U13.C3(VDD) U13.E9(VDD) U13.F11(VDD) U13.H1(VDD) U13.J11(VDD) U13.L5(VDD) U13.L7(VDD)
1V8: C62.2 C63.2 C64.2 C65.2 C66.2 C67.2 FB4.1 R22.2 R23.2 R24.1 R25.2 R26.2 R27.2 U13.B1(VIO4) U13.C11(VIO5) U13.E3(VIO3) U13.F1(VIO2) U13.H11(VIO1) U13.L9(VIO1) U16.8(VCC)
+5V: U12.5(OUT) U13.E11(VBUS)  [also labelled VBUS]
GND: C60.1 C61.1 C62.1 C63.1 C64.1 C65.1 C66.1 C67.1 C68.1 C69.1 C70.1 C71.1 C72.1 C73.1 C74.1 C75.1 C76.1 C77.1 C78.1 C79.1 C80.1 C81.1 C91.1 C92.2 C93.2 J2.0(Shield) J2.A1(GND) J2.A12(GND) J2.B1(GND) J2.B12(GND) P2.1 P3.5 P3.6 P4.3 R16.2 R17.2 R19.2 R20.2 R21.2 R28.2 R41.2 U12.2(GND) U12.3(~{EN}) U13.A1(U3VSSQ) U13.A8(VSS) U13.B7(AVSS) U13.B8(VSS) U13.B9(VSS) U13.D8(VSS) U13.E2(VSS) U13.G1(VSS) U13.G11(VSS) U13.K3(VSS) U13.K4(VSS) U13.L1(VSS) U13.L2(VSS) U13.L3(VSS) U13.L6(VSS) U13.L11(VSS) U14.3(GND) U14.8(GND) U15.3(GND) U15.8(GND) U16.3(A2) U16.4(GND) U16.7(WP) U17.2(GND) U18.3(GND) U18.8(GND)
LDO_3V3: C91.2 U17.3(Vcc)
VUSB: J2.A4(VBUS) J2.A9(VBUS) J2.B4(VBUS) J2.B9(VBUS) U12.1(IN)
B1_N: C88.2 U17.11(B1n)
B1_P: C87.2 U17.12(B1p)
C1_N: C90.2 U17.7(C1n)
C1_P: C89.2 U17.8(C1p)
CAM_GPIO: P3.4 U13.G7(GPIO[21])
FPGA_CLK: U13.J6(GPIO[16])
FPGA_CTL0: U13.K8(GPIO[17])
FPGA_CTL1: U13.J7(GPIO[19])
FPGA_D0: U13.F10(GPIO[0])
FPGA_D1: U13.F9(GPIO[1])
FPGA_D2: U13.F7(GPIO[2])
FPGA_D3: U13.G10(GPIO[3])
FPGA_D4: U13.G9(GPIO[4])
FPGA_D5: U13.F8(GPIO[5])
FPGA_D6: U13.H10(GPIO[6])
FPGA_D7: U13.H9(GPIO[7])
FPGA_D8: U13.J10(GPIO[8])
FPGA_D9: U13.J9(GPIO[9])
FPGA_D10: U13.K11(GPIO[10])
FPGA_D11: U13.L10(GPIO[11])
FPGA_D12: U13.K10(GPIO[12])
FPGA_D13: U13.K9(GPIO[13])
FPGA_D14: U13.J8(GPIO[14])
FPGA_D15: U13.G8(GPIO[15])
FPGA_D16: U13.K2(GPIO[33])
FPGA_D17: U13.J4(GPIO[34])
FPGA_D18: U13.K1(GPIO[35])  [project net DQ0_MOSI]
FPGA_D19: U13.J2(GPIO[36])
FPGA_D20: U13.J3(GPIO[37])
FPGA_D21: U13.J1(GPIO[38])
FPGA_D22: U13.H2(GPIO[39])
FPGA_D23: U13.H3(GPIO[40])
FPGA_D24: U13.F4(GPIO[41])
FPGA_D25: U13.G2(GPIO[42])
FPGA_D26: U13.G3(GPIO[43])
FPGA_D27: U13.F3(GPIO[44])
FPGA_D28: U13.F5(GPIO[46])
FPGA_D29: U13.E1(GPIO[47])  [project net DQ1_MISO]
FPGA_D30: U13.E5(GPIO[48])
FPGA_D31: U13.E4(GPIO[49])
FX3_SSRX_N: U13.A3(SSRXM) U17.1(A0n)
FX3_SSRX_P: U13.A4(SSRXP) U17.16(A0p)
FX3_SSTX_N: U13.A6(SSTXM) U17.5(A1n)
FX3_SSTX_P: U13.A5(SSTXP) U17.4(A1p)
GPIO22: P3.2 U13.G6(GPIO[22])
GPIO24: P3.1 U13.H8(GPIO[24])
GPIO26: P3.3 U13.H6(GPIO[26])
LED: LED1.A U13.D1(GPIO[50])
PMOD0: R25.1 U13.G4(GPIO[30])
PMOD1: R26.1 U13.H4(GPIO[31])
PMOD2: R27.1 U13.L4(GPIO[32])
SCL_1V8: R24.2 U13.D9(I2C_GPIO[58]) U16.6(SCL)
SDA_1V8: R23.1 U13.D10(I2C_GPIO[59]) U16.5(SDA)
SS_D_N: J2.A7(Dn1) J2.B7(Dn2) U13.A10(DM) U15.5 U15.6
SS_D_P: J2.A6(Dp1) J2.B6(Dp2) U13.A9(DP) U15.4 U15.7
SS_RX1_N: J2.B10(SSRXn1) U14.4 U14.7 U17.9(C0n)
SS_RX1_P: J2.B11(SSRXp1) U14.5 U14.6 U17.10(C0p)
SS_RX2_N: J2.A10(SSRXn2) U17.13(B0n) U18.1 U18.10
SS_RX2_P: J2.A11(SSRXp2) U17.14(B0p) U18.2 U18.9
SS_TX1_N: C90.1 J2.A3(SSTXn1) U15.2 U15.9
SS_TX1_P: C89.1 J2.A2(SSTXp1) U15.1 U15.10
SS_TX2_N: C88.1 J2.B3(SSTXn2) U14.2 U14.9
SS_TX2_P: C87.1 J2.B2(SSTXp2) U14.1 U14.10
UART_CTS: U13.C1(GPIO[54])
UART_RX: P4.2 U13.D5(GPIO[56])  [project net DQ2]
UART_TX: P4.1 U13.C2(GPIO[55])  [project net DQ3]
USB3_MUX_OE: R28.1 U13.D3(GPIO[52]) U17.15(OEn)
USB3_MUX_SEL: U17.6(SEL)
USB_~{TRST}: P2.6 U13.B11(TRST#)
USB_TCK: P2.2 U13.F6(TCK)
USB_TDI: P2.3 U13.E7(TDI)
USB_TDO: P2.5 U13.C10(TDO)
USB_TMS: P2.4 U13.E8(TMS)
NetC60_2: C60.2 C61.2 FB4.2 U13.B6(CVDDQ)
NetC76_2: C76.2 C77.2 FB5.2 U13.A7(AVDD)
NetC78_2: C78.2 U13.C6(XTALIN) X2.1(X1)
NetC79_2: C79.2 U13.C7(XTALOUT) X2.3(X2)
NetC80_2: C80.2 C92.1 FB6.2 U13.B5(U3TXVDDQ)
NetC81_2: C81.2 C93.1 FB7.2 U13.A2(U3RXVDDQ)
NetJ2_A5: J2.A5(CC1) R17.1
NetJ2_B5: J2.B5(CC2) R16.1
NetLED1_K: LED1.K R41.1
NetR19_1: R19.1 U13.C8(R_USB2)
NetR20_1: R20.1 U13.B3(R_USB3)
NetR21_1: R21.1 U13.B2(FSLC[0]) U13.B4(FSLC[1]) U13.E6(FSLC[2])
NetR22_1: R22.1 U13.C5(RESET#)

Not connected (* = marked no-connect by the designer): J2 A8(SBU1) B8(SBU2); U12 4(FLAG); U13 A11(NC) C4(GPIO[57]) C9(OTG_ID) D2(GPIO[51]) D4(GPIO[53]) D6(CLKIN_32) D7(CLKIN) D11(O[60]) E10(VBATT) F2(GPIO[45]) G5(GPIO[25]) H5(GPIO[29]) H7(GPIO[20]) J5(GPIO[28]) K5(GPIO[27]) K6(GPIO[23]) K7(GPIO[18]) L8(INT#); U18 4 5 6 7; X2 2(NC) 4(NC)

### Layout directives
differential pair: B1_N, B1_P, C1_N, C1_P, FX3_SSRX_N, FX3_SSRX_P, FX3_SSTX_N, FX3_SSTX_P, SS_D_N, SS_D_P, SS_RX1_N, SS_RX1_P, SS_RX2_N, SS_RX2_P, SS_TX1_N, SS_TX1_P, SS_TX2_N, SS_TX2_P
net class USB2: SS_D_N, SS_D_P
net class GPIF: FPGA_CLK, FPGA_CTL0, FPGA_CTL1, FPGA_D0, FPGA_D1, FPGA_D2, FPGA_D3, FPGA_D4, FPGA_D5, FPGA_D6, FPGA_D7, FPGA_D8, FPGA_D9, FPGA_D10, FPGA_D11, FPGA_D12, FPGA_D13, FPGA_D14, FPGA_D15, FPGA_D16, FPGA_D17, FPGA_D18, FPGA_D19, FPGA_D20, FPGA_D21, FPGA_D22, FPGA_D23, FPGA_D24, FPGA_D25, FPGA_D26, FPGA_D27, FPGA_D28, FPGA_D29, FPGA_D30, FPGA_D31
net class USB3: SS_RX1_N, SS_RX1_P, SS_RX2_N, SS_RX2_P, SS_TX1_N, SS_TX1_P, SS_TX2_N, SS_TX2_P
net class USB3FX: FX3_SSRX_N, FX3_SSRX_P, FX3_SSTX_N, FX3_SSTX_P

### Notes on the sheet
- Crosslink NX USB3 Cam Generic
- www.CircuitValley.com <http://www.CircuitValley.com>
- (near U13) USB 3.0
- Labels drawn without touching a wire or pin: FPGA_CTL2, FPGA_CTL3
- Title
- Size:
- Date:
- A3
- Number:
- Time:
- Revision:
- Sheet
- of
- File:
- (in symbol USB_C) USB C

### Library data of the parts
C60-C81 C91 = CAPC_10p_0603_NP0_1%_50V: as C1 on sheet cam_cross_link; Tolerance: ±5%; Operating Temperature: -55°C ~ 125°C; Package / Case: 0603 (1608 Metric); Size / Dimension: 0.063" L x 0.032" W (1.60mm x 0.81mm); Thickness (Max): 0.035" (0.90mm); Supplier 1: Digi-Key; Supplier Part Number 1: GRM1885C1H100FA01J-ND
  C60 C62-C67 C70-C76 C80 C81 C91: Value: 100n
  C61 C68 C69: Value: 10n
  C77: Value: 2.2u
  C78 C79: Value: 7pf
C87-C90 = CAPC_10n_0402_16V_10%: Capacitor SMD Cer 10nF 10% 16V X7R 0402; Manufacturer 1: AVX Corporation; Manufacturer Part Number 1: 0402YC103KAT2A; Ratings: 16V; X7R; Tolerance: ±10%; Operating Temperature: -55°C ~ 125°C; Package / Case: 0402 (1005 Metric); Size / Dimension: 0.039" L x 0.020" W (1.00mm x 0.50mm); Manufacturer 2: Yageo; Manufacturer Part Number 2: CC0402KRX7R7BB103; Supplier 1: Digi-Key; Supplier Part Number 1: 478-1114-1-ND; ComponentLink1URL: http://www.avx.com/docs/Catalogs/cx7r.pdf; ComponentLink1Description: http://www.avx.com/docs/Catalogs/cx7r.pdf; Supplier 2: Digi-Key; Supplier Part Number 2: 311-1042-1-ND; ComponentLink2URL: http://www.yageo.com/documents/recent/UPY-GPHC_X7R_6.3V-to-50V_8.pdf; ComponentLink2Description: http://www.yageo.com/documents/recent/UPY-GPHC_X7R_6.3V-to-50V_8.pdf; Value: 100n
C92 C93 = CAPT_47u_1210_6V3: as C31 on sheet camera; Package / Case: 1210 (3528 Metric); Tolerance: ±20%; Material: Tantalum; Supplier 1: Digi-Key; Supplier Part Number 1: 478-3139-1-ND; Operating Temperature: -55°C ~ 125°C; Size / Dimension: 0.138" L x 0.110" W (3.50mm x 2.80mm); Height - Seated (Max): 0.083" (2.10mm); ComponentLink1URL: http://www.avx.com/docs/Catalogs/tcj.pdf; ComponentLink1Description: http://www.avx.com/docs/Catalogs/tcj.pdf; Value: 22uf
FB4-FB7 = FERRITE_0805: as FB1 on sheet cam_cross_link; Size / Dimension: 0.063" L x 0.031" W (1.60mm x 0.80mm); Current Rating: 200mA; Package / Case: 0805 (2012 Metric); Height (Max): 0.043" (1.09mm); ComponentLink1URL: http://www.lairdtech.com/WorkArea/linkit.aspx?LinkIdentifier=id&ItemID=4879; ComponentLink1Description: http://www.lairdtech.com/WorkArea/linkit.aspx?LinkIdentifier=id&ItemID=4879; Supplier 1: Digi-Key; Supplier Part Number 1: 240-2562-1-ND; Mounting Type: Surface Mount
J2 = USB_C
LED1 = LED_SMD_Red_0603_220mcd: LED 0603 SMD Hyper Red 630nm 220mcd 20mA; Manufacturer 1: Kingbright Corp; Manufacturer Part Number 1: APT1608SURCK; Material: AlGaInP on GaAs; Ratings: 220 mcd; 630 nm; Voltage - Forward (Vf) Typ: 1.95V; Voltage - Forward (Vf) @ 10mA: 1.9V; Package / Case: 0603 (1608 metric); Supplier 1: Digi-Key; Supplier Part Number 1: 754-1123-1-ND
P2 P3 = Header 6: Header, 6-Pin; LatestRevisionDate: 17-Jul-2002; LatestRevisionNote: Re-released for DXP Platform.; Publisher: Altium Limited
P4 = Header 3: Header, 3-Pin; LatestRevisionDate: 17-Jul-2002; LatestRevisionNote: Re-released for DXP Platform.; Publisher: Altium Limited
R16 R17 R19-R28 R41 = RES_0R_0603: as R29 on sheet cam_cross_link; Package / Case: 0603 (1608metric); Supplier 1: Digi-Key; Supplier Part Number 1: 541-0.0GCT-ND
U12 = NCP360SNT1G: USB Overvoltage Protection
U13 = CYUSB3014-BZXC: EZ-USB(R) FX3: SuperSpeed USB Controller, 512 KB, 60 I/Os, 0 to 70 degC, 121-Pin FBGA (BZX121); Manufacturer: Cypress; CPU Core: ARM926 EJ-S; Max. Operating Voltage (V): 1.25; Memory Architecture: SRAM; Memory Size (KB): 512; Min. Operating Voltage (V): 1.15; No. of I/Os: 60; DatasheetVersion: Rev. *O; PackageVersion: Rev. *D; PackageReference: BZX121; PackageDescription: 121-Ball FBGA, Body 10 x 10 mm, Pitch 0.8 mm; Supplier 1: Digi-Key; Supplier Part Number 1: 428-3182-ND; Supplier 2: Farnell; Supplier Part Number 2: 2355789; Supplier 3: Newark; Supplier Part Number 3: 54W7901; Supplier 4: Mouser; Supplier Part Number 4: 727-CYUSB3014-BZXC; Max. Operating Temp. (degreesC): 70; Min. Operating Temp. (degreesC): 0; RoHS: Pb-Free; Mounting Technology: Surface Mount; Code_JEDEC: PUB 95; PartNumber: CYUSB3014-BZXC; ComponentLink1Description: Manufacturer URL; ComponentLink1URL: http://www.cypress.com/; ComponentLink2Description: Datasheet; ComponentLink2URL: http://www.cypress.com/?docID=49087; ComponentLink3Description: Package Specification; ComponentLink3URL: http://www.cypress.com/?docID=45795
U14 U15 U18 = SP3010-04UTG: ESD Protection
U16 = AT24CM02: 2Mbit I2C EEPROM
U17 = HD3SS3202: USB 3.0 Mux
X2 = Crystal: Crystal Oscillator

## Nets that join several sheets
1V0: cam_cross_link (16 pins), power (C39.1 C42.2 L2.2 R10.1)
1V2: power (C52.1 C59.2 L5.2 R8.1), usb (19 pins)
1V8: power (C43.1 C46.2 L3.2 R12.1), usb (20 pins)
+5V: camera (5 pins), power (25 pins), usb (U12.5 U13.E11)
FPGA_1V8: cam_cross_link (17 pins), power (C96.1 C99.2 L6.2 R36.1)
GND: cam_cross_link (30 pins), camera (16 pins), power (46 pins), usb (69 pins)
LDO_1V0: cam_cross_link (FB2.1 FB3.1), power (C53.2 C54.1 U9.5)
LDO_1V8: cam_cross_link (10 pins), power (C56.1 C82.2 U10.7 U10.8)
LDO_3V3: power (C97.1 C101.2 U20.5), usb (C91.2 U17.3)
CAM_CLK_N: cam_cross_link (R1.1 U1.69), camera (J1.8)
CAM_CLK_P: cam_cross_link (R1.2 U1.68), camera (J1.9)
CAM_D0_N: cam_cross_link (R5.1 U1.65), camera (J1.2)
CAM_D0_P: cam_cross_link (R5.2 U1.64), camera (J1.3)
CAM_D1_N: cam_cross_link (R3.1 U1.67), camera (J1.5)
CAM_D1_P: cam_cross_link (R3.2 U1.66), camera (J1.6)
CAM_D2_N: cam_cross_link (R4.1 U1.2), camera (J1.17)
CAM_D2_P: cam_cross_link (R4.2 U1.1), camera (J1.18)
CAM_D3_N: cam_cross_link (R2.1 U1.3), camera (J1.20)
CAM_D3_P: cam_cross_link (R2.2 U1.4), camera (J1.21)
CAM_GPIO: camera (J1.11), usb (P3.4 U13.G7)
DQ0_MOSI: cam_cross_link (R29.2 U1.57), usb (U13.K1)
DQ1_MISO: cam_cross_link (R30.2 U1.51), usb (U13.E1)
DQ2: cam_cross_link (R31.2 U1.55), usb (P4.2 U13.D5)
DQ3: cam_cross_link (R32.2 U1.52), usb (P4.1 U13.C2)
FPGA_CLK: cam_cross_link (U1.30), usb (U13.J6)
FPGA_CTL0: cam_cross_link (U1.61), usb (U13.K8)
FPGA_CTL1: cam_cross_link (R42.2 U1.60), usb (U13.J7)
FPGA_D0: cam_cross_link (U1.8), usb (U13.F10)
FPGA_D1: cam_cross_link (U1.10), usb (U13.F9)
FPGA_D2: cam_cross_link (U1.11), usb (U13.F7)
FPGA_D3: cam_cross_link (U1.13), usb (U13.G10)
FPGA_D4: cam_cross_link (U1.14), usb (U13.G9)
FPGA_D5: cam_cross_link (U1.9), usb (U13.F8)
FPGA_D6: cam_cross_link (U1.15), usb (U13.H10)
FPGA_D7: cam_cross_link (U1.16), usb (U13.H9)
FPGA_D8: cam_cross_link (U1.19), usb (U13.J10)
FPGA_D9: cam_cross_link (U1.24), usb (U13.J9)
FPGA_D10: cam_cross_link (U1.20), usb (U13.K11)
FPGA_D11: cam_cross_link (U1.23), usb (U13.L10)
FPGA_D12: cam_cross_link (U1.22), usb (U13.K10)
FPGA_D13: cam_cross_link (U1.25), usb (U13.K9)
FPGA_D14: cam_cross_link (U1.27), usb (U13.J8)
FPGA_D15: cam_cross_link (U1.28), usb (U13.G8)
FPGA_D16: cam_cross_link (U1.42), usb (U13.K2)
FPGA_D17: cam_cross_link (U1.31), usb (U13.J4)
FPGA_D19: cam_cross_link (U1.43), usb (U13.J2)
FPGA_D20: cam_cross_link (R40.2 U1.59 U2.6), usb (U13.J3)
FPGA_D21: cam_cross_link (U1.44), usb (U13.J1)
FPGA_D22: cam_cross_link (P1.5 U1.45), usb (U13.H2)
FPGA_D23: cam_cross_link (U1.58), usb (U13.H3)
FPGA_D24: cam_cross_link (U1.36), usb (U13.F4)
FPGA_D25: cam_cross_link (P1.4 U1.46), usb (U13.G2)
FPGA_D26: cam_cross_link (U1.34), usb (U13.G3)
FPGA_D27: cam_cross_link (P1.3 U1.48), usb (U13.F3)
FPGA_D28: cam_cross_link (U1.33), usb (U13.F5)
FPGA_D30: cam_cross_link (U1.37), usb (U13.E5)
FPGA_D31: cam_cross_link (P1.6 R43.2 U1.41), usb (U13.E4)
SCL_1V8: camera (J1.13), usb (R24.2 U13.D9 U16.6)
SDA_1V8: camera (J1.14), usb (R23.1 U13.D10 U16.5)
UART_CTS: cam_cross_link (U1.53), usb (U13.C1)